# EAGLE schematic studna_V2 (EAGLE 9.0.1)
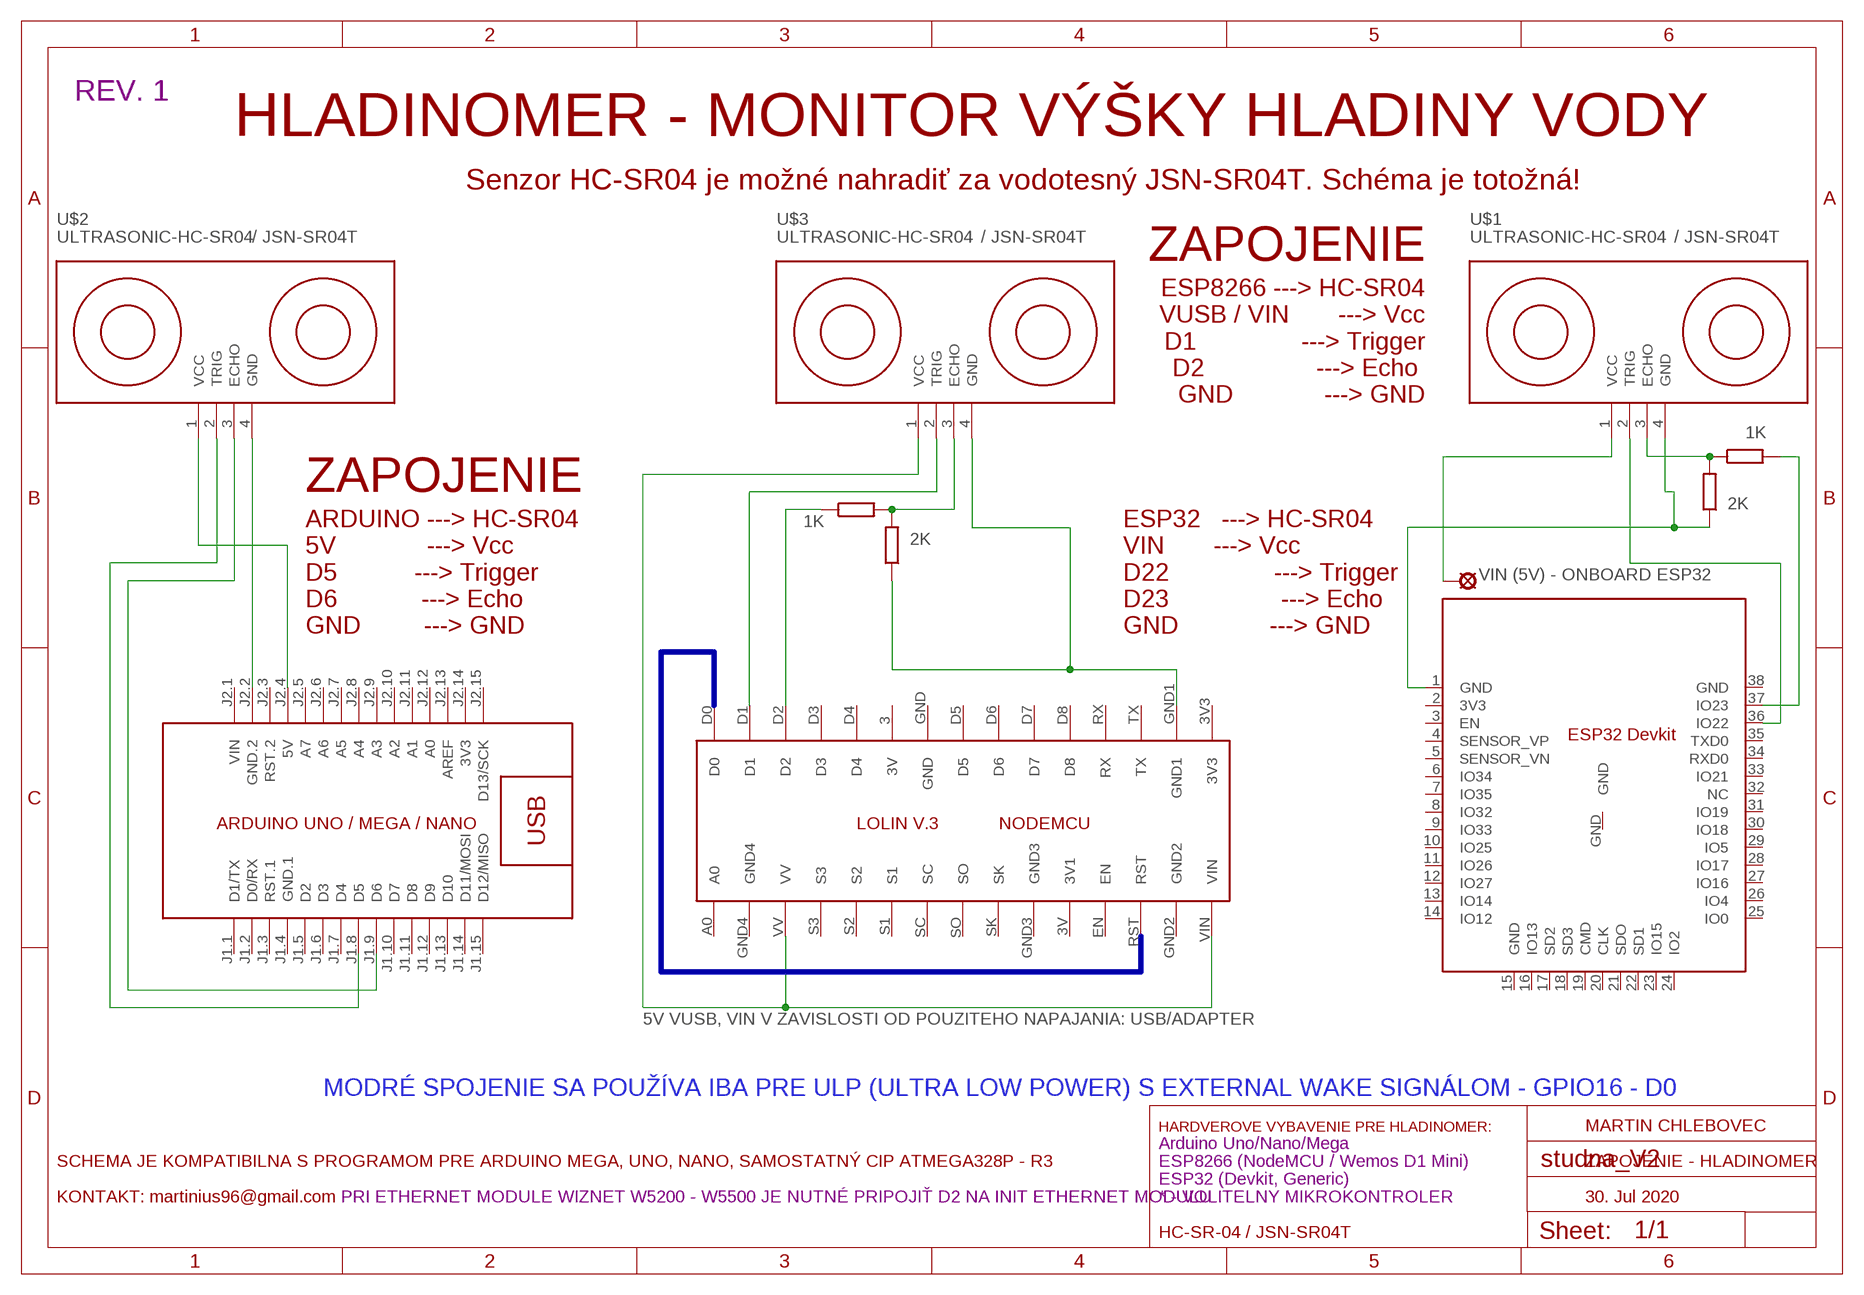
[diagram p0: schematic, sheet 1]

## Parts
IC1  LOLINV3  [LOLINV3]
LSP1  MCS10B  [MCS10B]
M1  ARDUINO-NANO-3.0  [ARDUINO-NANO-3.0]
U1  ESP-WROOM-32  [ESP-WROOM-32]
U$1  ULTRASONIC-HC-SR04  [ULTRASONIC-HC-SR04]
U$2  ULTRASONIC-HC-SR04  [ULTRASONIC-HC-SR04]
U$3  ULTRASONIC-HC-SR04  [ULTRASONIC-HC-SR04]

## Nets
N$1: M1.J2.2(GND.2) U$2.4(GND)
N$2: M1.J2.4(5V) U$2.1(VCC)
N$3: U$3.3(ECHO)
N$4: IC1.D2
N$5: IC1.D1 U$3.2(TRIG)
N$6: U$1.3(ECHO)
N$7: IC1.GND1 U$3.4(GND)
N$9: U1.36(IO22) U$1.2(TRIG)
N$10: U1.37(IO23)
N$11: U1.1(GND) U$1.4(GND)
N$12: LSP1.MP U$1.1(VCC)
N$14: IC1.VIN IC1.VV U$3.1(VCC)
N$15: M1.J1.9(D6) U$2.3(ECHO)
N$16: M1.J1.8(D5) U$2.2(TRIG)
Unconnected: IC1.3(3V) IC1.3V3 IC1.3V(3V1) IC1.A0 IC1.D0 IC1.D3 IC1.D4 IC1.D5 IC1.D6 IC1.D7 IC1.D8 IC1.EN IC1.GND IC1.GND2 IC1.GND3 IC1.GND4 IC1.RST IC1.RX IC1.S1 IC1.S2 IC1.S3 IC1.SC IC1.SK IC1.SO IC1.TX M1.J1.1(D1/TX) M1.J1.2(D0/RX) M1.J1.3(RST.1) M1.J1.5(D2) M1.J1.6(D3) M1.J1.7(D4) M1.J1.10(D7) M1.J1.11(D8) M1.J1.12(D9) M1.J1.13(D10) M1.J1.14(D11/MOSI) M1.J1.15(D12/MISO) M1.J2.3(RST.2) M1.J2.5(A7) M1.J2.6(A6) M1.J2.7(A5) M1.J2.8(A4) M1.J2.9(A3) M1.J2.10(A2) M1.J2.11(A1) M1.J2.12(A0) M1.J2.13(AREF) M1.J2.15(D13/SCK) U1.2(3V3) U1.3(EN) U1.4(SENSOR_VP) U1.5(SENSOR_VN) U1.6(IO34) U1.7(IO35) U1.8(IO32) U1.9(IO33) U1.10(IO25) U1.11(IO26) U1.12(IO27) U1.13(IO14) U1.14(IO12) U1.15(GND) U1.16(IO13) U1.17(SD2) U1.18(SD3) U1.19(CMD) U1.20(CLK) U1.21(SDO) U1.22(SD1) U1.23(IO15) U1.24(IO2) U1.25(IO0) U1.26(IO4) U1.27(IO16) U1.28(IO17) U1.29(IO5) U1.30(IO18) U1.31(IO19) U1.32(NC) U1.33(IO21) U1.34(RXD0) U1.35(TXD0) U1.38(GND) U1.GND

## Buses
B$1

## Notes on the sheet
- REV. 1
- HLADINOMER - MONITOR VÝŠKY HLADINY VODY
- Senzor HC-SR04 je možné nahradiť za vodotesný JSN-SR04T. Schéma je totožná!
- / JSN-SR04T | / JSN-SR04T | / JSN-SR04T
- ZAPOJENIE
- ESP8266 ---> HC-SR04
  VUSB / VIN       ---> Vcc
  D1               ---> Trigger
  D2                ---> Echo 
  GND             ---> GND
- 1K
- ZAPOJENIE
- 2K
- 1K
- 2K
- VIN (5V) - ONBOARD ESP32
- ARDUINO ---> HC-SR04
  5V             ---> Vcc
  D5           ---> Trigger
  D6            ---> Echo 
  GND         ---> GND
- ESP32   ---> HC-SR04
  VIN       ---> Vcc
  D22               ---> Trigger
  D23                ---> Echo 
  GND             ---> GND
- ESP32 Devkit
- ARDUINO UNO / MEGA / NANO
- 5V VUSB, VIN V ZAVISLOSTI OD POUZITEHO NAPAJANIA: USB/ADAPTER
- MODRÉ SPOJENIE SA POUŽÍVA IBA PRE ULP (ULTRA LOW POWER) S EXTERNAL WAKE SIGNÁLOM - GPIO16 - D0
- HARDVEROVE VYBAVENIE PRE HLADINOMER: | MARTIN CHLEBOVEC
- Arduino Uno/Nano/Mega
- SCHEMA JE KOMPATIBILNA S PROGRAMOM PRE ARDUINO MEGA, UNO, NANO, SAMOSTATNÝ CIP ATMEGA328P - R3 | ESP8266 (NodeMCU / Wemos D1 Mini) | ZAPOJENIE - HLADINOMER
- ESP32 (Devkit, Generic)
- KONTAKT: martinius96@gmail.com | PRI ETHERNET MODULE WIZNET W5200 - W5500 JE NUTNÉ PRIPOJIŤ D2 NA INIT ETHERNET MODULU | * - VOLITELNY MIKROKONTROLER | 30. Jul 2020
- HC-SR-04 / JSN-SR04T

## Power pins joined to a net without a drawn wire
3V3: M1.J2.14(3V3)
GND.1: M1.J1.4(GND.1)
VIN: M1.J2.1(VIN)

## Library data of the parts
IC1 = Lolin:LOLINV3
LSP1 = solpad:MCS10B: SOLDER PAD MC S1, distributor Buerklin, 15F505
M1 = diy-modules (2):ARDUINO-NANO-3.0: Arduino Nano 3.0 and compatible devices More details available here: https://www.arduino.cc/en/Main/ArduinoBoardNano Click here to find device on ebay.com <http://www.ebay.com/sch/arduino+nano>
U1 = esp32:ESP-WROOM-32
U$1-U$3 = diy-modules (2):ULTRASONIC-HC-SR04: Ultrasonic Ranging Module HC-SR04 More details available here: http://randomnerdtutorials.com/complete-guide-for-ultrasonic-sensor-hc-sr04/ Click here to find device on ebay.com <http://www.ebay.com/sch/hc+sr04+ultrasonic>